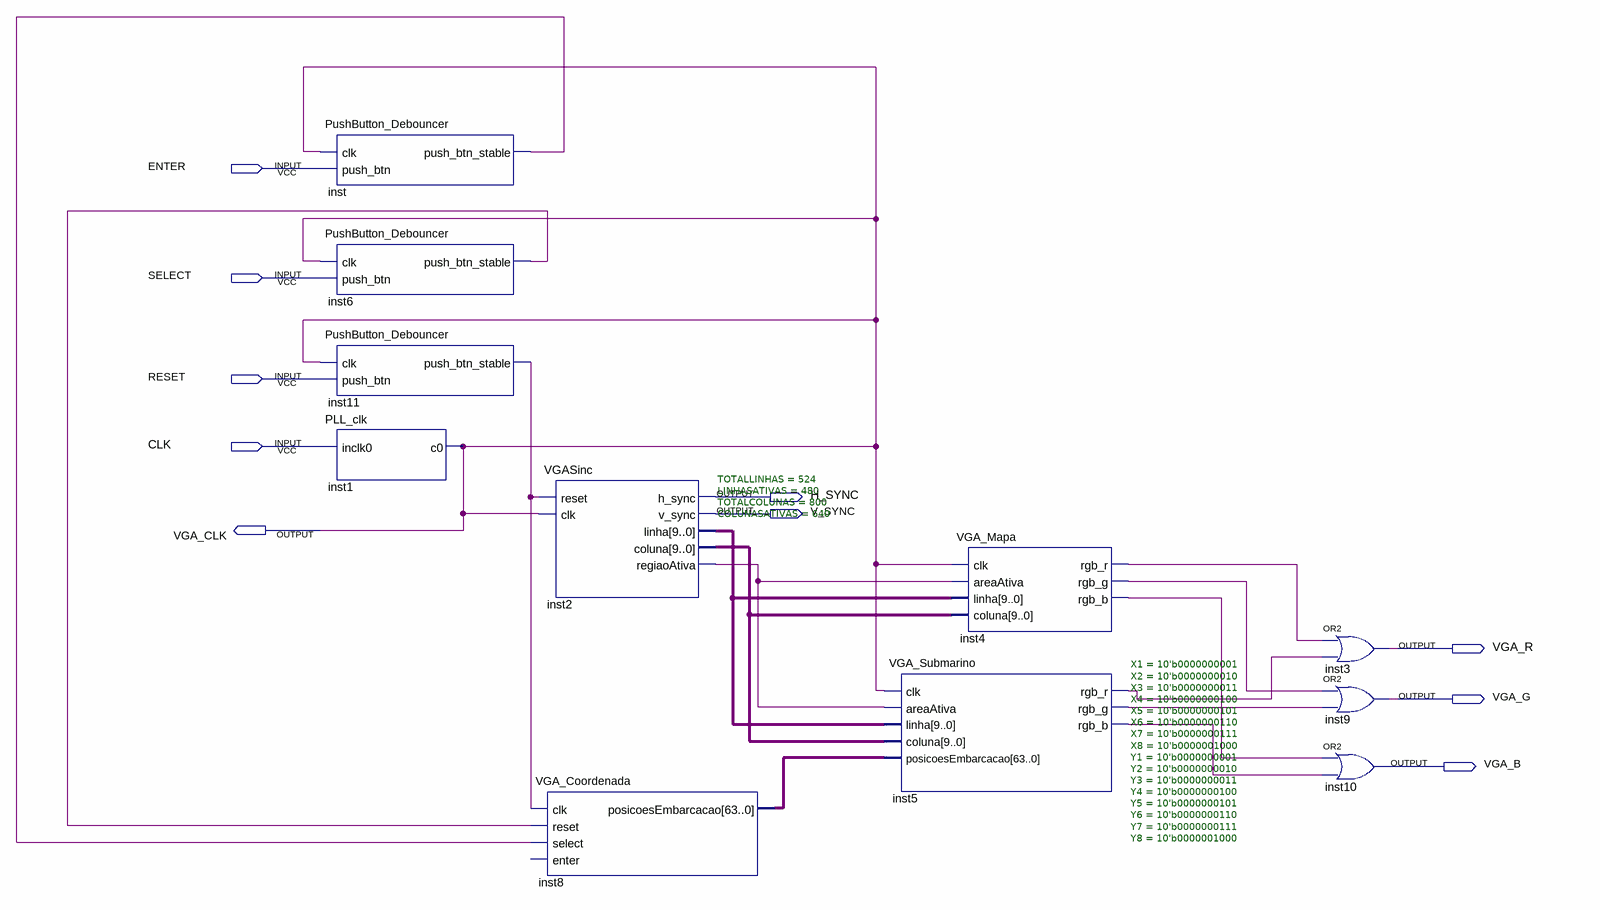
[diagram p0: schematic sheet]
// Quartus schematic TopLevel.bdf as structural Verilog: 11 symbols, 10 pins
module TopLevel (
  input  ENTER,
  input  SELECT,
  input  RESET,
  input  CLK,
  output H_SYNC,
  output V_SYNC,
  output VGA_CLK,
  output VGA_R,
  output VGA_G,
  output VGA_B
);

  wire inst2_regiaoativa, inst4_rgb_b, inst4_rgb_g, inst4_rgb_r, inst5_rgb_b, inst5_rgb_g, inst5_rgb_r,
       inst6_push_btn_stable, inst11_push_btn_stable, inst_push_btn_stable;
  wire [9:0] inst2_coluna, inst2_linha;
  wire [63:0] inst8_posicoesembarcacao;

  PushButton_Debouncer inst (.clk(VGA_CLK), .push_btn(ENTER), .push_btn_stable(inst_push_btn_stable));
  PushButton_Debouncer inst6 (.clk(VGA_CLK), .push_btn(SELECT), .push_btn_stable(inst6_push_btn_stable));
  PushButton_Debouncer inst11 (.clk(VGA_CLK), .push_btn(RESET), .push_btn_stable(inst11_push_btn_stable));
  PLL_clk inst1 (.inclk0(CLK), .c0(VGA_CLK));
  VGASinc #(.TOTALLINHAS(524), .LINHASATIVAS(480), .TOTALCOLUNAS(800), .COLUNASATIVAS(640)) inst2 (
    .reset(inst11_push_btn_stable), .clk(VGA_CLK), .h_sync(H_SYNC), .v_sync(V_SYNC), .linha(inst2_linha),
    .coluna(inst2_coluna), .regiaoAtiva(inst2_regiaoativa));
  VGA_Coordenada inst8 (
    .clk(inst11_push_btn_stable), .reset(inst6_push_btn_stable), .select(inst_push_btn_stable),
    .posicoesEmbarcacao(inst8_posicoesembarcacao));  // open: enter
  VGA_Submarino #(.X1(10'b0000000001), .X2(10'b0000000010), .X3(10'b0000000011), .X4(10'b0000000100), .X5(10'b0000000101), .X6(10'b0000000110), .X7(10'b0000000111), .X8(10'b0000001000), .Y1(10'b0000000001), .Y2(10'b0000000010), .Y3(10'b0000000011), .Y4(10'b0000000100), .Y5(10'b0000000101), .Y6(10'b0000000110), .Y7(10'b0000000111), .Y8(10'b0000001000)) inst5 (
    .clk(VGA_CLK), .areaAtiva(inst2_regiaoativa), .linha(inst2_linha), .coluna(inst2_coluna),
    .posicoesEmbarcacao(inst8_posicoesembarcacao), .rgb_r(inst5_rgb_r), .rgb_g(inst5_rgb_g),
    .rgb_b(inst5_rgb_b));
  VGA_Mapa inst4 (
    .clk(VGA_CLK), .areaAtiva(inst2_regiaoativa), .linha(inst2_linha), .coluna(inst2_coluna),
    .rgb_r(inst4_rgb_r), .rgb_g(inst4_rgb_g), .rgb_b(inst4_rgb_b));
  or inst3 (VGA_R, inst4_rgb_r, inst5_rgb_r);
  or inst9 (VGA_G, inst4_rgb_g, inst5_rgb_g);
  or inst10 (VGA_B, inst4_rgb_b, inst5_rgb_b);
endmodule
